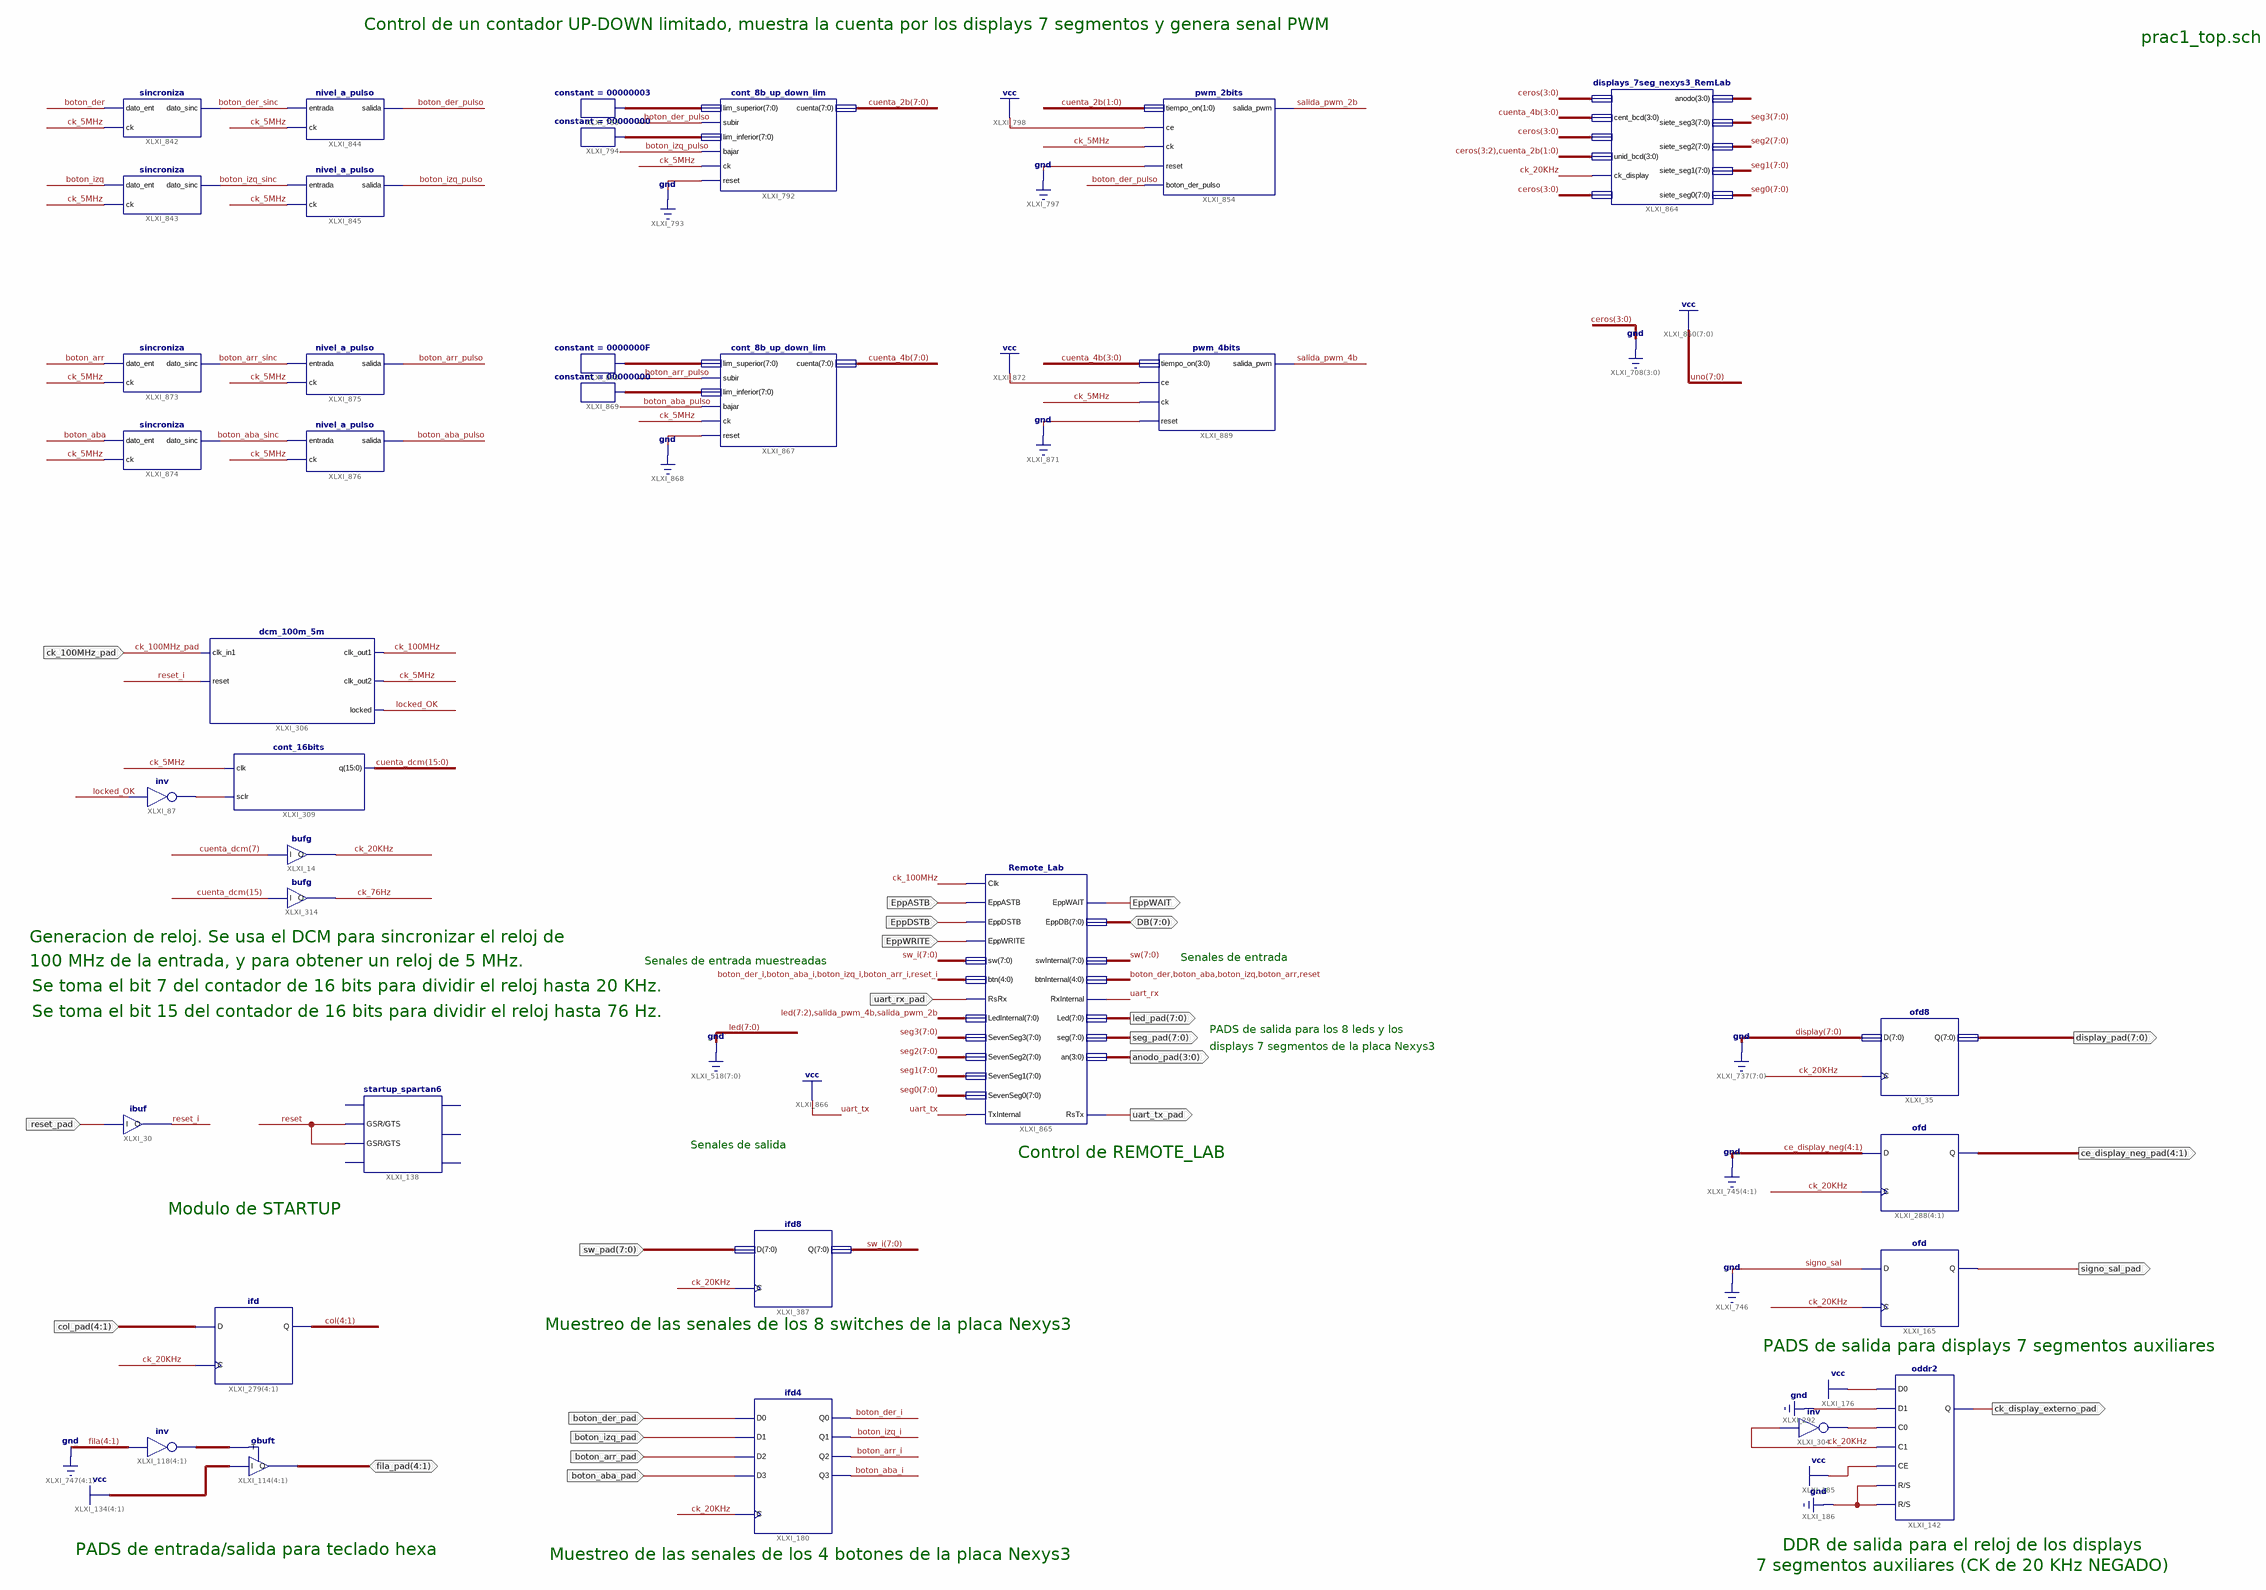
[diagram p0: schematic sheet 1]
// Xilinx ISE schematic prac1_top.sch (spartan6) as structural Verilog: 35 symbols, 23 ports
module prac1_top (
  input  [4:1] col_pad,
  input  reset_pad,
  input  boton_der_pad,
  input  boton_izq_pad,
  input  boton_arr_pad,
  input  boton_aba_pad,
  input  [7:0] sw_pad,
  input  ck_100MHz_pad,
  input  EppASTB,
  input  EppDSTB,
  input  EppWRITE,
  input  uart_rx_pad,
  inout  [4:1] fila_pad,
  inout  [7:0] DB,
  output [7:0] display_pad,
  output [4:1] ce_display_neg_pad,
  output signo_sal_pad,
  output ck_display_externo_pad,
  output EppWAIT,
  output [7:0] led_pad,
  output [7:0] seg_pad,
  output [3:0] anodo_pad,
  output uart_tx_pad
);

  wire boton_aba, boton_aba_i, boton_aba_pulso, boton_aba_sinc, boton_arr, boton_arr_i, boton_arr_pulso,
       boton_arr_sinc, boton_der, boton_der_i, boton_der_pulso, boton_der_sinc, boton_izq, boton_izq_i,
       boton_izq_pulso, boton_izq_sinc, ck_5MHz, ck_20KHz, ck_76Hz, ck_100MHz, locked_OK, reset, reset_i,
       salida_pwm_2b, salida_pwm_4b, uart_rx, XLXN_1, XLXN_460;
  wire [3:0] XLXN_1877;
  wire [4:1] col, XLXN_407;
  wire [7:0] cuenta_2b, cuenta_4b, seg0, seg1, seg2, seg3, sw, sw_i, XLXN_1839, XLXN_1840, XLXN_1897,
       XLXN_1898;
  wire [15:0] cuenta_dcm;

  obuft XLXI_114[4:1] (.I(4'b1111), .T(XLXN_407), .O(fila_pad));
  assign XLXN_407 = ~4'b0000;  // inv XLXI_118[4..1], 4 bits wide
  ifd XLXI_279[4:1] (.C(ck_20KHz), .D(col_pad), .Q(col));
  ibuf XLXI_30 (.I(reset_pad), .O(reset_i));
  startup_spartan6 XLXI_138 (.GSR(reset), .GTS(reset));  // open: CLK, KEYCLEARB, CFGCLK, CFGMCLK, EOS
  ifd4 XLXI_180 (
    .C(ck_20KHz), .D0(boton_der_pad), .D1(boton_izq_pad), .D2(boton_arr_pad), .D3(boton_aba_pad),
    .Q0(boton_der_i), .Q1(boton_izq_i), .Q2(boton_arr_i), .Q3(boton_aba_i));
  ifd8 XLXI_387 (.C(ck_20KHz), .D(sw_pad), .Q(sw_i));
  dcm_100m_5m XLXI_306 (
    .clk_in1(ck_100MHz_pad), .clk_out1(ck_100MHz), .clk_out2(ck_5MHz), .reset(reset_i), .locked(locked_OK));
  cont_16bits XLXI_309 (.clk(ck_5MHz), .sclr(XLXN_1), .q(cuenta_dcm));
  not XLXI_87 (XLXN_1, locked_OK);
  bufg XLXI_14 (.I(cuenta_dcm[7]), .O(ck_20KHz));
  bufg XLXI_314 (.I(cuenta_dcm[15]), .O(ck_76Hz));
  cont_8b_up_down_lim XLXI_792 (
    .lim_superior(XLXN_1839), .subir(boton_der_pulso), .lim_inferior(XLXN_1840), .bajar(boton_izq_pulso),
    .ck(ck_5MHz), .reset(1'b0), .cuenta(cuenta_2b));
  constant #(.CValue("00000000")) XLXI_794 (.O(XLXN_1840));
  constant #(.CValue("00000003")) XLXI_795 (.O(XLXN_1839));
  sincroniza XLXI_842 (.dato_sinc(boton_der_sinc), .ck(ck_5MHz), .dato_ent(boton_der));
  sincroniza XLXI_843 (.dato_sinc(boton_izq_sinc), .ck(ck_5MHz), .dato_ent(boton_izq));
  nivel_a_pulso XLXI_844 (.salida(boton_der_pulso), .ck(ck_5MHz), .entrada(boton_der_sinc));
  nivel_a_pulso XLXI_845 (.salida(boton_izq_pulso), .ck(ck_5MHz), .entrada(boton_izq_sinc));
  displays_7seg_nexys3_RemLab XLXI_864 (
    .mill_bcd(4'b0000), .cent_bcd(cuenta_4b[3:0]), .dec_bcd(4'b0000), .unid_bcd({2'b00, cuenta_2b[1:0]}),
    .ck_display(ck_20KHz), .punto_dec(4'b0000), .anodo(XLXN_1877), .siete_seg3(seg3), .siete_seg2(seg2),
    .siete_seg1(seg1), .siete_seg0(seg0));
  ofd XLXI_288[4:1] (.C(ck_20KHz), .D(4'b0000), .Q(ce_display_neg_pad));
  ofd XLXI_165 (.C(ck_20KHz), .D(1'b0), .Q(signo_sal_pad));
  oddr2 XLXI_142 (
    .D0(1'b1), .D1(1'b0), .C0(XLXN_460), .C1(ck_20KHz), .CE(1'b1), .R(1'b0), .Q(ck_display_externo_pad),
    .S(1'b0));
  not XLXI_304 (XLXN_460, ck_20KHz);
  ofd8 XLXI_35 (.C(ck_20KHz), .D({8{1'b0}}), .Q(display_pad));
  Remote_Lab XLXI_865 (
    .Clk(ck_100MHz), .EppASTB(EppASTB), .EppDSTB(EppDSTB), .EppWRITE(EppWRITE), .RsRx(uart_rx_pad),
    .TxInternal(1'b1), .sw(sw_i), .btn({boton_der_i, boton_aba_i, boton_izq_i, boton_arr_i, reset_i}),
    .LedInternal({{6{1'b0}}, salida_pwm_4b, salida_pwm_2b}), .SevenSeg3(seg3), .SevenSeg2(seg2),
    .SevenSeg1(seg1), .SevenSeg0(seg0), .EppDB(DB), .EppWAIT(EppWAIT), .RxInternal(uart_rx),
    .RsTx(uart_tx_pad), .swInternal(sw), .btnInternal({boton_der, boton_aba, boton_izq, boton_arr, reset}),
    .Led(led_pad), .seg(seg_pad), .an(anodo_pad));
  cont_8b_up_down_lim XLXI_867 (
    .lim_superior(XLXN_1897), .subir(boton_arr_pulso), .lim_inferior(XLXN_1898), .bajar(boton_aba_pulso),
    .ck(ck_5MHz), .reset(1'b0), .cuenta(cuenta_4b));
  constant #(.CValue("00000000")) XLXI_869 (.O(XLXN_1898));
  constant #(.CValue("0000000F")) XLXI_870 (.O(XLXN_1897));
  sincroniza XLXI_873 (.dato_sinc(boton_arr_sinc), .ck(ck_5MHz), .dato_ent(boton_arr));
  sincroniza XLXI_874 (.dato_sinc(boton_aba_sinc), .ck(ck_5MHz), .dato_ent(boton_aba));
  nivel_a_pulso XLXI_875 (.salida(boton_arr_pulso), .ck(ck_5MHz), .entrada(boton_arr_sinc));
  nivel_a_pulso XLXI_876 (.salida(boton_aba_pulso), .ck(ck_5MHz), .entrada(boton_aba_sinc));
  pwm_4bits XLXI_889 (.ce(1'b1), .ck(ck_5MHz), .reset(1'b0), .salida_pwm(salida_pwm_4b), .tiempo_on(cuenta_4b[3:0]));
  pwm_2bits XLXI_854 (
    .boton_der_pulso(boton_der_pulso), .ce(1'b1), .ck(ck_5MHz), .reset(1'b0), .salida_pwm(salida_pwm_2b),
    .tiempo_on(cuenta_2b[1:0]));

  // Notes on the sheet:
  //   Control de un contador UP-DOWN limitado, muestra la cuenta por los displays 7 segmentos y genera senal PWM
  //   prac1_top.sch
  //   Generacion de reloj. Se usa el DCM para sincronizar el reloj de
  //   Senales de entrada
  //   100 MHz de la entrada, y para obtener un reloj de 5 MHz.
  //   Senales de entrada muestreadas
  //   Se toma el bit 7 del contador de 16 bits para dividir el reloj hasta 20 KHz.
  //   Se toma el bit 15 del contador de 16 bits para dividir el reloj hasta 76 Hz.
  //   PADS de salida para los 8 leds y los
  //   displays 7 segmentos de la placa Nexys3
  //   Senales de salida
  //   Control de REMOTE_LAB
  //   Modulo de STARTUP
  //   Muestreo de las senales de los 8 switches de la placa Nexys3
  //   PADS de salida para displays 7 segmentos auxiliares
  //   DDR de salida para el reloj de los displays
  //   PADS de entrada/salida para teclado hexa
  //   Muestreo de las senales de los 4 botones de la placa Nexys3
  //   7 segmentos auxiliares (CK de 20 KHz NEGADO)
endmodule
